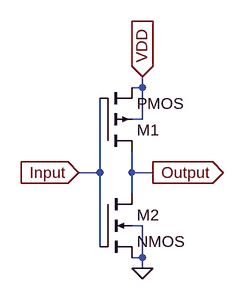
[diagram p0: schematic Inverter.asc]
Inverter.asc, the LTspice schematic file:
Version 4.1
SHEET 1 880 680
WIRE 208 48 208 32
WIRE 208 48 192 48
WIRE 208 96 208 48
WIRE 208 96 192 96
WIRE 144 176 144 64
WIRE 144 176 112 176
WIRE 192 176 192 144
WIRE 224 176 192 176
WIRE 192 208 192 176
WIRE 208 256 192 256
WIRE 144 288 144 176
WIRE 208 304 208 256
WIRE 208 304 192 304
WIRE 208 320 208 304
FLAG 224 176 Output
IOPIN 224 176 Out
FLAG 112 176 Input
IOPIN 112 176 In
FLAG 208 32 VDD
IOPIN 208 32 In
FLAG 208 320 0
SYMBOL pmos4 144 144 M180
SYMATTR InstName M1
SYMATTR Value2 l=1 w=4
SYMBOL nmos4 144 208 R0
SYMATTR InstName M2
SYMATTR Value2 l=1 w=2

The netlist it stands for:
* Inverter.asc
M1 Output Input VDD VDD PMOS l=1 w=4
M2 Output Input 0 0 NMOS l=1 w=2
.model NMOS NMOS
.model PMOS PMOS
.lib standard.mos
.backanno
.end